# Altium schematic sheet Sheet1.SchDoc
size A4
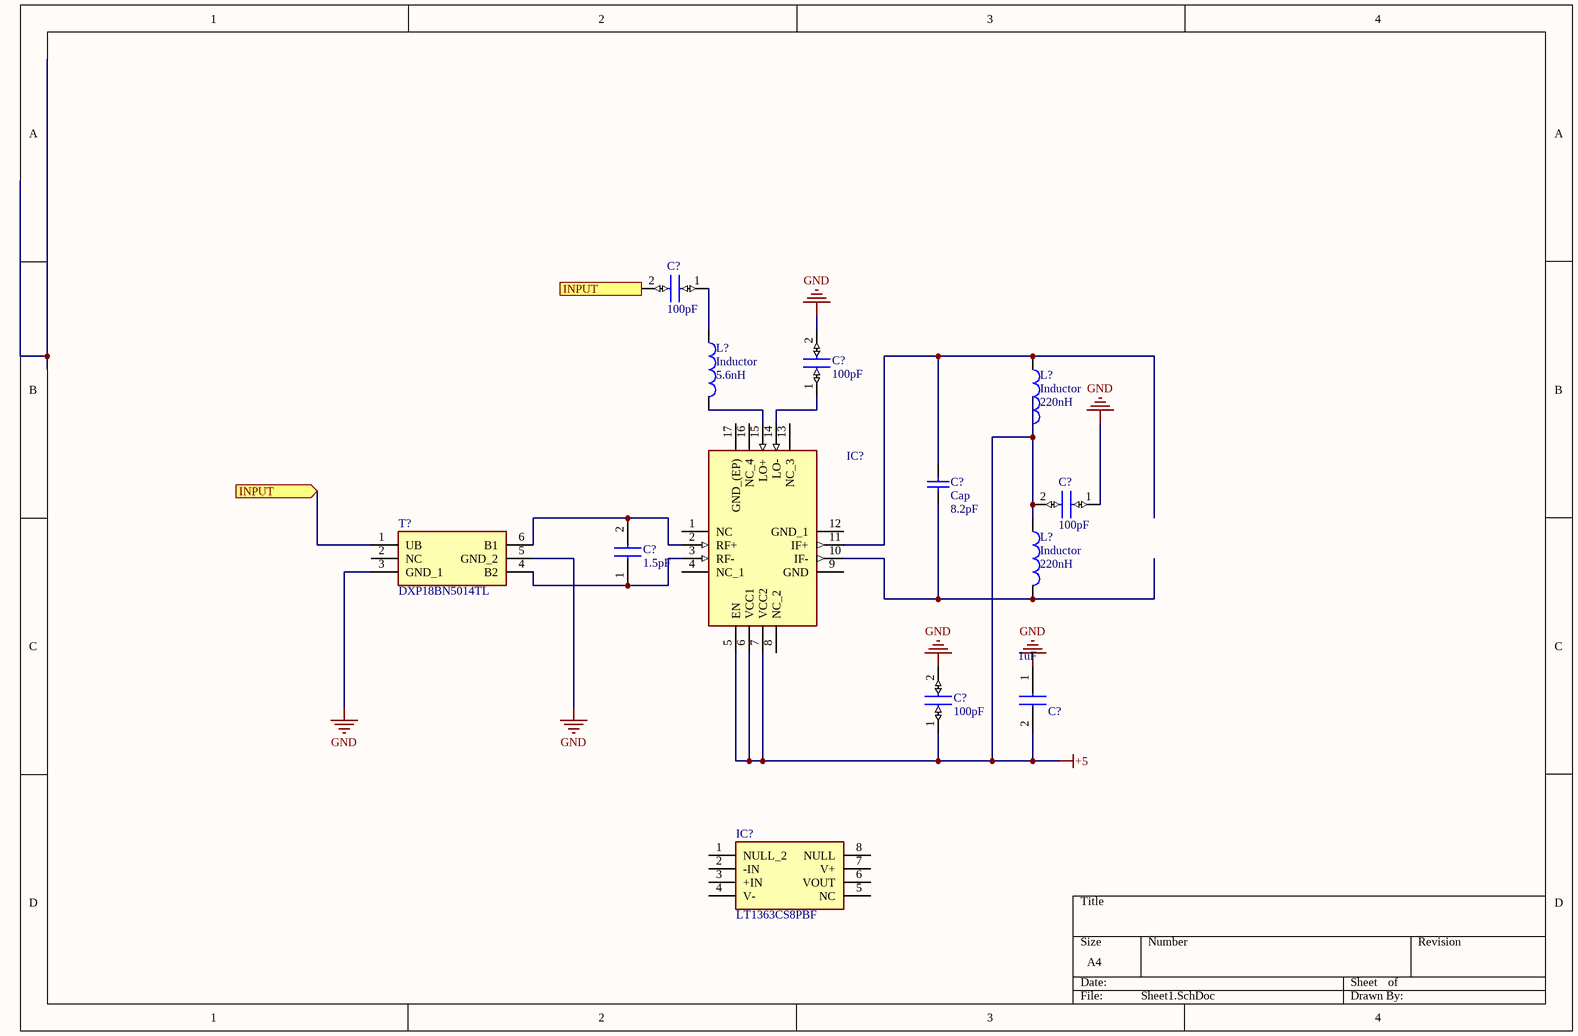
[diagram p0: Sheet1.SchDoc]

## Parts
(Parts that share a designator on the sheet are numbered #1, #2 ... from top to bottom, then left to right.)
C?#1  100pF  [CAPC1608X87N]
C?#2  100pF  [CAPC1608X87N]
C?#3  Cap  value 8.2pF  [RAD-0.3]
C?#4  100pF  [CAPC1608X87N]
C?#5  1.5pF  [CAPC1608X90N]
C?#6  1uF  [CAPC2012X100N]
C?#7  100pF  [CAPC1608X87N]
IC?#1  LT5512EUF#PBF  [QFN65P400X400X80-17N-D]  (value not drawn)
IC?#2  LT1363CS8PBF  [SOIC127P600X175-8N]
L?#1  Inductor  value 5.6nH  [0402-A]
L?#2  Inductor  value 220nH  [0402-A]
L?#3  Inductor  value 220nH  [0402-A]
T?  DXP18BN5014TL  [DXP18BN5014TL]

## Ports
INPUT (in)

## Nets
+5: C?#4.2 C?#6.2 C?#7.1 IC?#1.5(EN) IC?#1.6(VCC1) IC?#1.7(VCC2) L?#2.2 L?#3.1
GND: C?#2.2 C?#4.1 C?#6.1 C?#7.2 T?.3(GND_1) T?.5(GND_2)
INPUT: C?#1.2 T?.1(UB) ; port INPUT
NetC?#1_1: C?#1.1 L?#1.1
NetC?#2_1: C?#2.1 IC?#1.14(LO-)
NetC?#3_1: C?#3.1 IC?#1.10(IF-) L?#3.2
NetC?#3_2: C?#3.2 IC?#1.11(IF+) L?#2.1
NetC?#5_1: C?#5.1 IC?#1.3(RF-) T?.4(B2)
NetC?#5_2: C?#5.2 IC?#1.2(RF+) T?.6(B1)
NetIC?#1_15: IC?#1.15(LO+) L?#1.2

Not connected (* = marked no-connect by the designer): IC?#1 1(NC) 4(NC_1) 8(NC_2) 9(GND) 12(GND_1) 13(NC_3) 16(NC_4) 17(GND_(EP)); IC?#2 1(NULL_2) 2(-IN) 3(+IN) 4(V-) 5(NC) 6(VOUT) 7(V+) 8(NULL); T? 2(NC)

## Library data of the parts
C?#1 C?#2 C?#4 C?#7 = C0603C101J5GACTU: Capacitor; Manufacturer_Name: Kemet; Allied_Number: 70096904; Datasheet Link: http://docs-emea.rs-online.com/webdocs/116e/0900766b8116eaf8.pdf; Height: 0.87mm; Manufacturer_Part_Number: C0603C101J5GACTU; Mouser Part Number: 80-C0603C101J5G; Mouser Price/Stock: https://www.mouser.com/Search/Refine.aspx?Keyword=80-C0603C101J5G; RS Part Number: 2644523P; RS Price/Stock: http://uk.rs-online.com/web/p/products/2644523P; Allied Price/Stock: https://www.alliedelec.com/kemet-c0603c101j5gactu/70096904/
C?#3 = Cap: Capacitor; Published: 8-Jun-2000; LatestRevisionDate: 17-Jul-2002; LatestRevisionNote: Re-released for DXP Platform.; PackageReference: RAD-0.3; Publisher: Altium Limited; PackageDescription: Radial Cap, Thru-Hole; 2 Leads; 0.3 in Pin Spacing
C?#5 = 06032U1R5BAT2A: Capacitor; Manufacturer_Name: AVX; Allied_Number: 70473499; Datasheet Link: http://www.mouser.com/catalog/supplier/library/pdf/AVXSurfaceMountCeramic.pdf; Height: 0.9mm; Manufacturer_Part_Number: 06032U1R5BAT2A; Mouser Part Number: 581-06032U1R5BAT2A; Mouser Price/Stock: http://www.mouser.com/Search/ProductDetail.aspx?qs=HHtk9%2fstK94%2fdhQq%2fiZoHQ%3d%3d; RS Part Number: 6983986; RS Price/Stock: https://uk.rs-online.com/web/p/products/6983986; Allied Price/Stock: https://www.alliedelec.com/avx-06032u1r5bat2a/70473499/
C?#6 = C0805C105K4RACTU: Capacitor; Manufacturer_Name: Kemet; Datasheet Link: http://www.kemet.com/Lists/ProductCatalog/Attachments/53/KEM_C1002_X7R_SMD.pdf; Height: 1mm; Manufacturer_Part_Number: C0805C105K4RACTU; Mouser Part Number: 80-C0805C105K4R; Mouser Price/Stock: https://www.mouser.com/Search/Refine.aspx?Keyword=80-C0805C105K4R; RS Part Number: 4515770P; RS Price/Stock: http://uk.rs-online.com/web/p/products/4515770P
IC?#1 = LT5512EUF#PBF: Integrated Circuit; Manufacturer_Name: Linear Technology; Datasheet Link: http://cds.linear.com/docs/en/datasheet/5512fa.pdf; Height: 0.8mm; Manufacturer_Part_Number: LT5512EUF#PBF; RS Part Number: 5060861P; RS Price/Stock: http://uk.rs-online.com/web/p/products/5060861P
IC?#2 = LT1363CS8PBF: Integrated Circuit; Manufacturer_Name: Linear Technology; Manufacturer_Part_Number: LT1363CS8PBF
L?#1-L?#3 = Inductor: Code_IEC: 1005; Published: 8-Jun-2000; LatestRevisionDate: 29-May-2009; LatestRevisionNote: IPC-7351 Footprint Added.; PackageReference: 0402-A; Publisher: Altium Limited; PackageDescription: Chip Inductor; Code_JEITA: 0402
T? = DXP18BN5014TL: Transformer; Manufacturer_Name: Murata Electronics; Datasheet Link: https://www.murata.com/en-us/products/productdata/8796776071198/EFKA0002.pdf; Height: 0.55mm; Manufacturer_Part_Number: DXP18BN5014TL; Mouser Part Number: 81-DXP18BN5014TL; Mouser Price/Stock: https://www.mouser.com/Search/Refine.aspx?Keyword=81-DXP18BN5014TL; RS Part Number: 8390904P; RS Price/Stock: http://uk.rs-online.com/web/p/products/8390904P